# Altium schematic sheet motordriver-v5.0_opto-isolation-ctrl.SchDoc
size A4; SheetNumber: 4; SheetTotal: 9
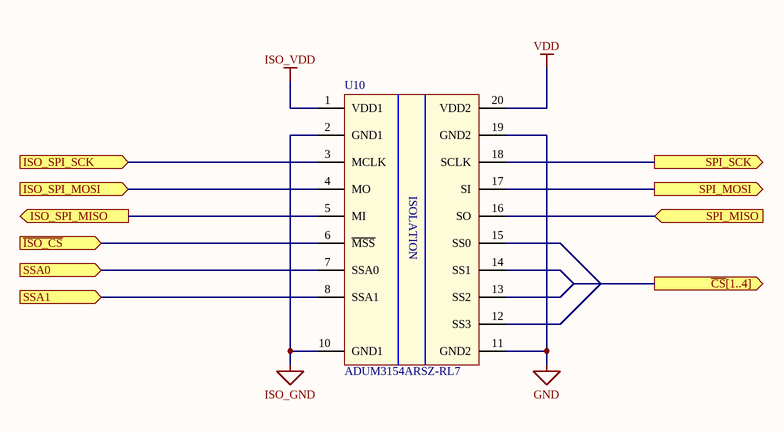
[diagram p0: motordriver-v5.0_opto-isolation-ctrl.SchDoc]

## Parts
U10  ADUM3154ARSZ-RL7  [20-SSOP]

## Ports
ISO_SPI_MISO (out), ISO_SPI_MOSI (in), ISO_SPI_SCK (in), SPI_MISO (in), SPI_MOSI (out), SPI_SCK (out), SSA0 (in), SSA1 (in), ~{CS}[1..4] (out), ~{ISO_CS} (in)

## Nets
GND: U10.11(GND2) U10.19(GND2)
ISO_GND: U10.2(GND1) U10.10(GND1)
ISO_VDD: U10.1(VDD1)
VDD: U10.20(VDD2)
~{ISO_CS}: U10.6(~{MSS}) ; port ~{ISO_CS}
ISO_SPI_MISO: U10.5(MI) ; port ISO_SPI_MISO
ISO_SPI_MOSI: U10.4(MO) ; port ISO_SPI_MOSI
ISO_SPI_SCK: U10.3(MCLK) ; port ISO_SPI_SCK
SPI_MISO: U10.16(SO) ; port SPI_MISO
SPI_MOSI: U10.17(SI) ; port SPI_MOSI
SPI_SCK: U10.18(SCLK) ; port SPI_SCK
SSA0: U10.7(SSA0) ; port SSA0
SSA1: U10.8(SSA1) ; port SSA1

Not connected (* = marked no-connect by the designer): U10 12(SS3) 13(SS2) 14(SS1) 15(SS0)

## Notes on the sheet
- (in symbol ISO ADUM3154ARSZ-RL7) ISOLATION

## Library data of the parts
U10 = ISO ADUM3154ARSZ-RL7: DGTL ISO 3.75KV 4CH SPI 20SSOP; Manufacturer: Analog Devices; Number of Channels: 4; Channel Type: Unidirectional; Data Rate: 34Mbps; Propagation Delay: 25ns; Max Supply Voltage: 5.5V; Min Supply Voltage: 3V; Operating Supply Current: 6.5mA; Max Power Dissipation: 1.4W; Isolated Power: No; Pulse Width Distortion (PWD): 2ns; Supplier 1: Digi-Key; Manufacturer Part Number: ADUM3154ARSZ-RL7; RoHS: Yes; Category: Interface ICs; Stock 1: 226; Pricing 1: 1=6.07000, 10=5.44900, 25=5.15160, 100=4.46470, 250=4.23576 (USD); Mount: Surface Mount; Case/Package: SSOP; Number of Pins: 20; Weight: 0.016oz; Contact Plating: Tin,Matte; Min Operating Temperature: -40°C; Max Operating Temperature: 125°C; Packaging: Tape and Reel; Polarity: Unidirectional; Turn-On Delay Time: 25ns; Package Quantity: 500; Lead Free: Contains Lead; RoHS Compliant: Yes; ComponentLink1URL: https://datasheet.ciiva.com/48509/adum3154-48509240.pdf?src-supplier=Avnet; ComponentLink1Description: https://datasheet.ciiva.com/48509/adum3154-48509240.pdf?src-supplier=Avnet; Supplier Part Number 1: ADUM3154ARSZ-RL7CT-ND